# Altium schematic sheet Power.SchDoc: Power: fuente lineal 7805 (hoja hija del ejemplo 06)
size A4; Author: Efrain Alvarado; CompanyName: Universidad de Cuenca - MCIE; DrawnBy: Efrain Alvarado; DocumentNumber: E06-P; Revision: 1.0; SheetNumber: 1; SheetTotal: 1
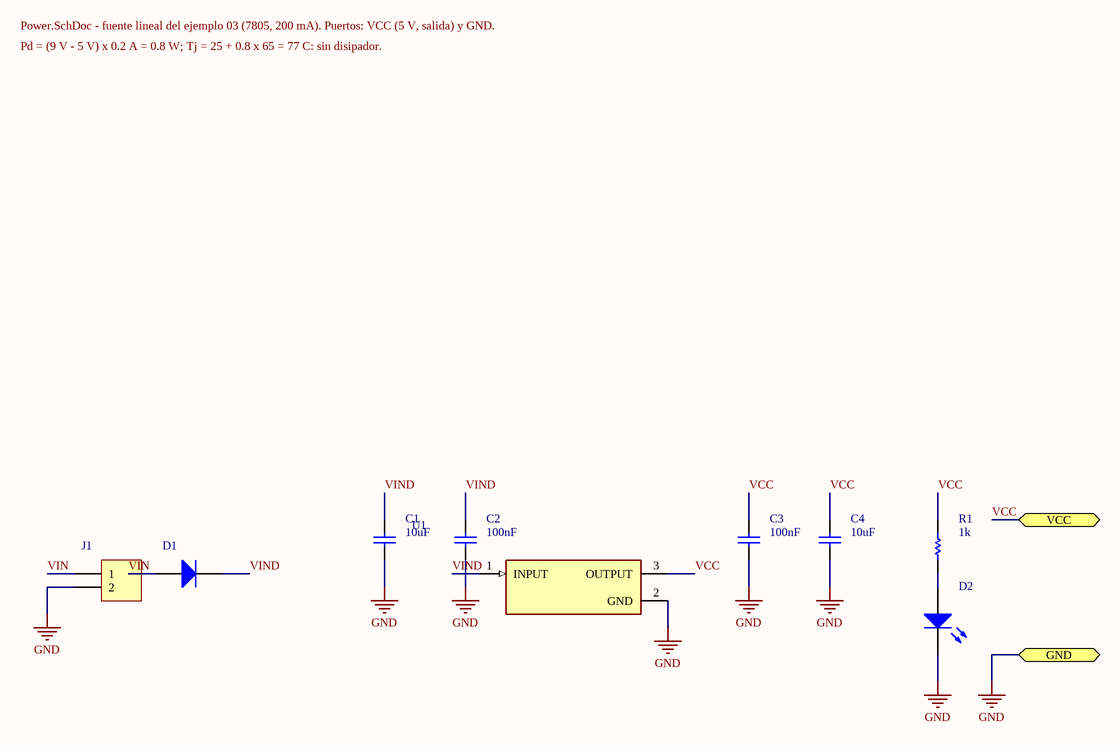
[diagram p0: Power.SchDoc]

## Parts
C1  value 10uF  [RAD-0.3]  (hidden comment: Cap)
C2  value 100nF  [RAD-0.3]  (hidden comment: Cap)
C3  value 100nF  [RAD-0.3]  (hidden comment: Cap)
C4  value 10uF  [RAD-0.3]  (hidden comment: Cap)
D1  Diode 1N4007  [DO-41]  (value not drawn)
D2  LED1  [LED-1]  (value not drawn)
J1  Header 2  [HDR1X2]  (value not drawn)
R1  value 1k  [AXIAL-0.3]  (hidden comment: Res1)
U1  LM7805T  [TO254P1011X457X1950-3]  (value not drawn)

## Ports
GND, VCC

## Nets
GND: C1.1 C2.1 C3.1 C4.1 D2.2(K) J1.2 U1.2(GND) ; port GND
VCC: C3.2 C4.2 R1.2 U1.3(OUTPUT) ; port VCC
VIN: D1.1(A) J1.1
VIND: C1.2 C2.2 D1.2(K) U1.1(INPUT)
NetD2_1: D2.1(A) R1.1

## Notes on the sheet
- Power.SchDoc - fuente lineal del ejemplo 03 (7805, 200 mA). Puertos: VCC (5 V, salida) y GND.
- Pd = (9 V - 5 V) x 0.2 A = 0.8 W; Tj = 25 + 0.8 x 65 = 77 C: sin disipador.

## Library data of the parts
C1 = Cap: Capacitor 10 uF (entrada); Manufacturer: KEMET; Manufacturer Part Number: C320C106K3R5TA; Published: 8-Jun-2000; LatestRevisionDate: 17-Jul-2002; LatestRevisionNote: Re-released for DXP Platform.; PackageReference: RAD-0.3; Publisher: Altium Limited; PackageDescription: Radial Cap, Thru-Hole; 2 Leads; 0.3 in Pin Spacing
C2 = Cap: Capacitor 100 nF (entrada); Manufacturer: KEMET; Manufacturer Part Number: C320C104K5R5TA; Published: 8-Jun-2000; LatestRevisionDate: 17-Jul-2002; LatestRevisionNote: Re-released for DXP Platform.; PackageReference: RAD-0.3; Publisher: Altium Limited; PackageDescription: Radial Cap, Thru-Hole; 2 Leads; 0.3 in Pin Spacing
C3 = Cap: Capacitor 100 nF (salida); Manufacturer: KEMET; Manufacturer Part Number: C320C104K5R5TA; Published: 8-Jun-2000; LatestRevisionDate: 17-Jul-2002; LatestRevisionNote: Re-released for DXP Platform.; PackageReference: RAD-0.3; Publisher: Altium Limited; PackageDescription: Radial Cap, Thru-Hole; 2 Leads; 0.3 in Pin Spacing
C4 = Cap: Capacitor 10 uF (salida); Manufacturer: KEMET; Manufacturer Part Number: C320C106K3R5TA; Published: 8-Jun-2000; LatestRevisionDate: 17-Jul-2002; LatestRevisionNote: Re-released for DXP Platform.; PackageReference: RAD-0.3; Publisher: Altium Limited; PackageDescription: Radial Cap, Thru-Hole; 2 Leads; 0.3 in Pin Spacing
D1 = Diode 1N4007: Diodo de proteccion de polaridad inversa; Manufacturer: Diodes Inc.; Published: 8-Jun-2000; LatestRevisionDate: 17-Jul-2002; LatestRevisionNote: Re-released for DXP Platform.; DatasheetVersion: 1998; PackageVersion: Aug-1999; PackageReference: DO-41; Publisher: Altium Limited; PackageDescription: Diode, Axial; Body 5.2 x 2.7 mm (LxDia. max), Lead Dia. 0.86 mm (max); Code_JEDEC: DO-204-AL; ComponentLink1Description: Manufacturer Link; ComponentLink1URL: http://www.fairchildsemi.com/; ComponentLink2Description: Datasheet; ComponentLink2URL: http://www.fairchildsemi.com/ds/1N%2F1N4001.pdf; Manufacturer Part Number: 1N4007
D2 = LED1: LED rojo 5 mm (encendido); Manufacturer: Kingbright; Manufacturer Part Number: WP7113ID; Published: 8-Jun-2000; LatestRevisionDate: 08-Jul-2005; LatestRevisionNote: Mech Layer 1 removed.; PackageReference: LED-1; Publisher: Altium Limited; PackageDescription: LED; 2 Leads
J1 = Header 2: Header 2 pin: Vin (7-12 V) y GND; Manufacturer: Generic; Manufacturer Part Number: Pin header 1x2; LatestRevisionDate: 17-Jul-2002; LatestRevisionNote: Re-released for DXP Platform.; Publisher: Altium Limited
R1 = Res1: Resistor 1 kohm 1/4 W (LED); Manufacturer: Yageo; Manufacturer Part Number: CFR-25JB-52-1K; Published: 8-Jun-2000; LatestRevisionDate: 17-Jul-2002; LatestRevisionNote: Re-released for DXP Platform.; PackageReference: AXIAL-0.3; Publisher: Altium Limited; PackageDescription: Axial Device, Thru-Hole; 2 Leads; 0.3 in Pin Spacing
U1 = LM7805T: Regulador lineal fijo 5 V, 1.5 A, TO-220; Manufacturer: STMicroelectronics; Manufacturer Part Number: L7805CV; MF: TAEJIN; SnapEDA_Link: https://www.snapeda.com/parts/LM7805T/TAEJIN/view-part/?ref=snap; Package: TO-220-3 TAEJIN; Value: *; MP: LM7805T; Check_prices: https://www.snapeda.com/parts/LM7805T/TAEJIN/view-part/?ref=eda